# EasyEDA schematic SCH_TEST_2024-05-06.json

## Sheets
1 Sheet_1: TITLE: Sheet_1; REV: 1.0; Date: 2024-03-07; Sheet: 1/1; Drawn By: phuoc.chauphuocchau; Company: Your Company
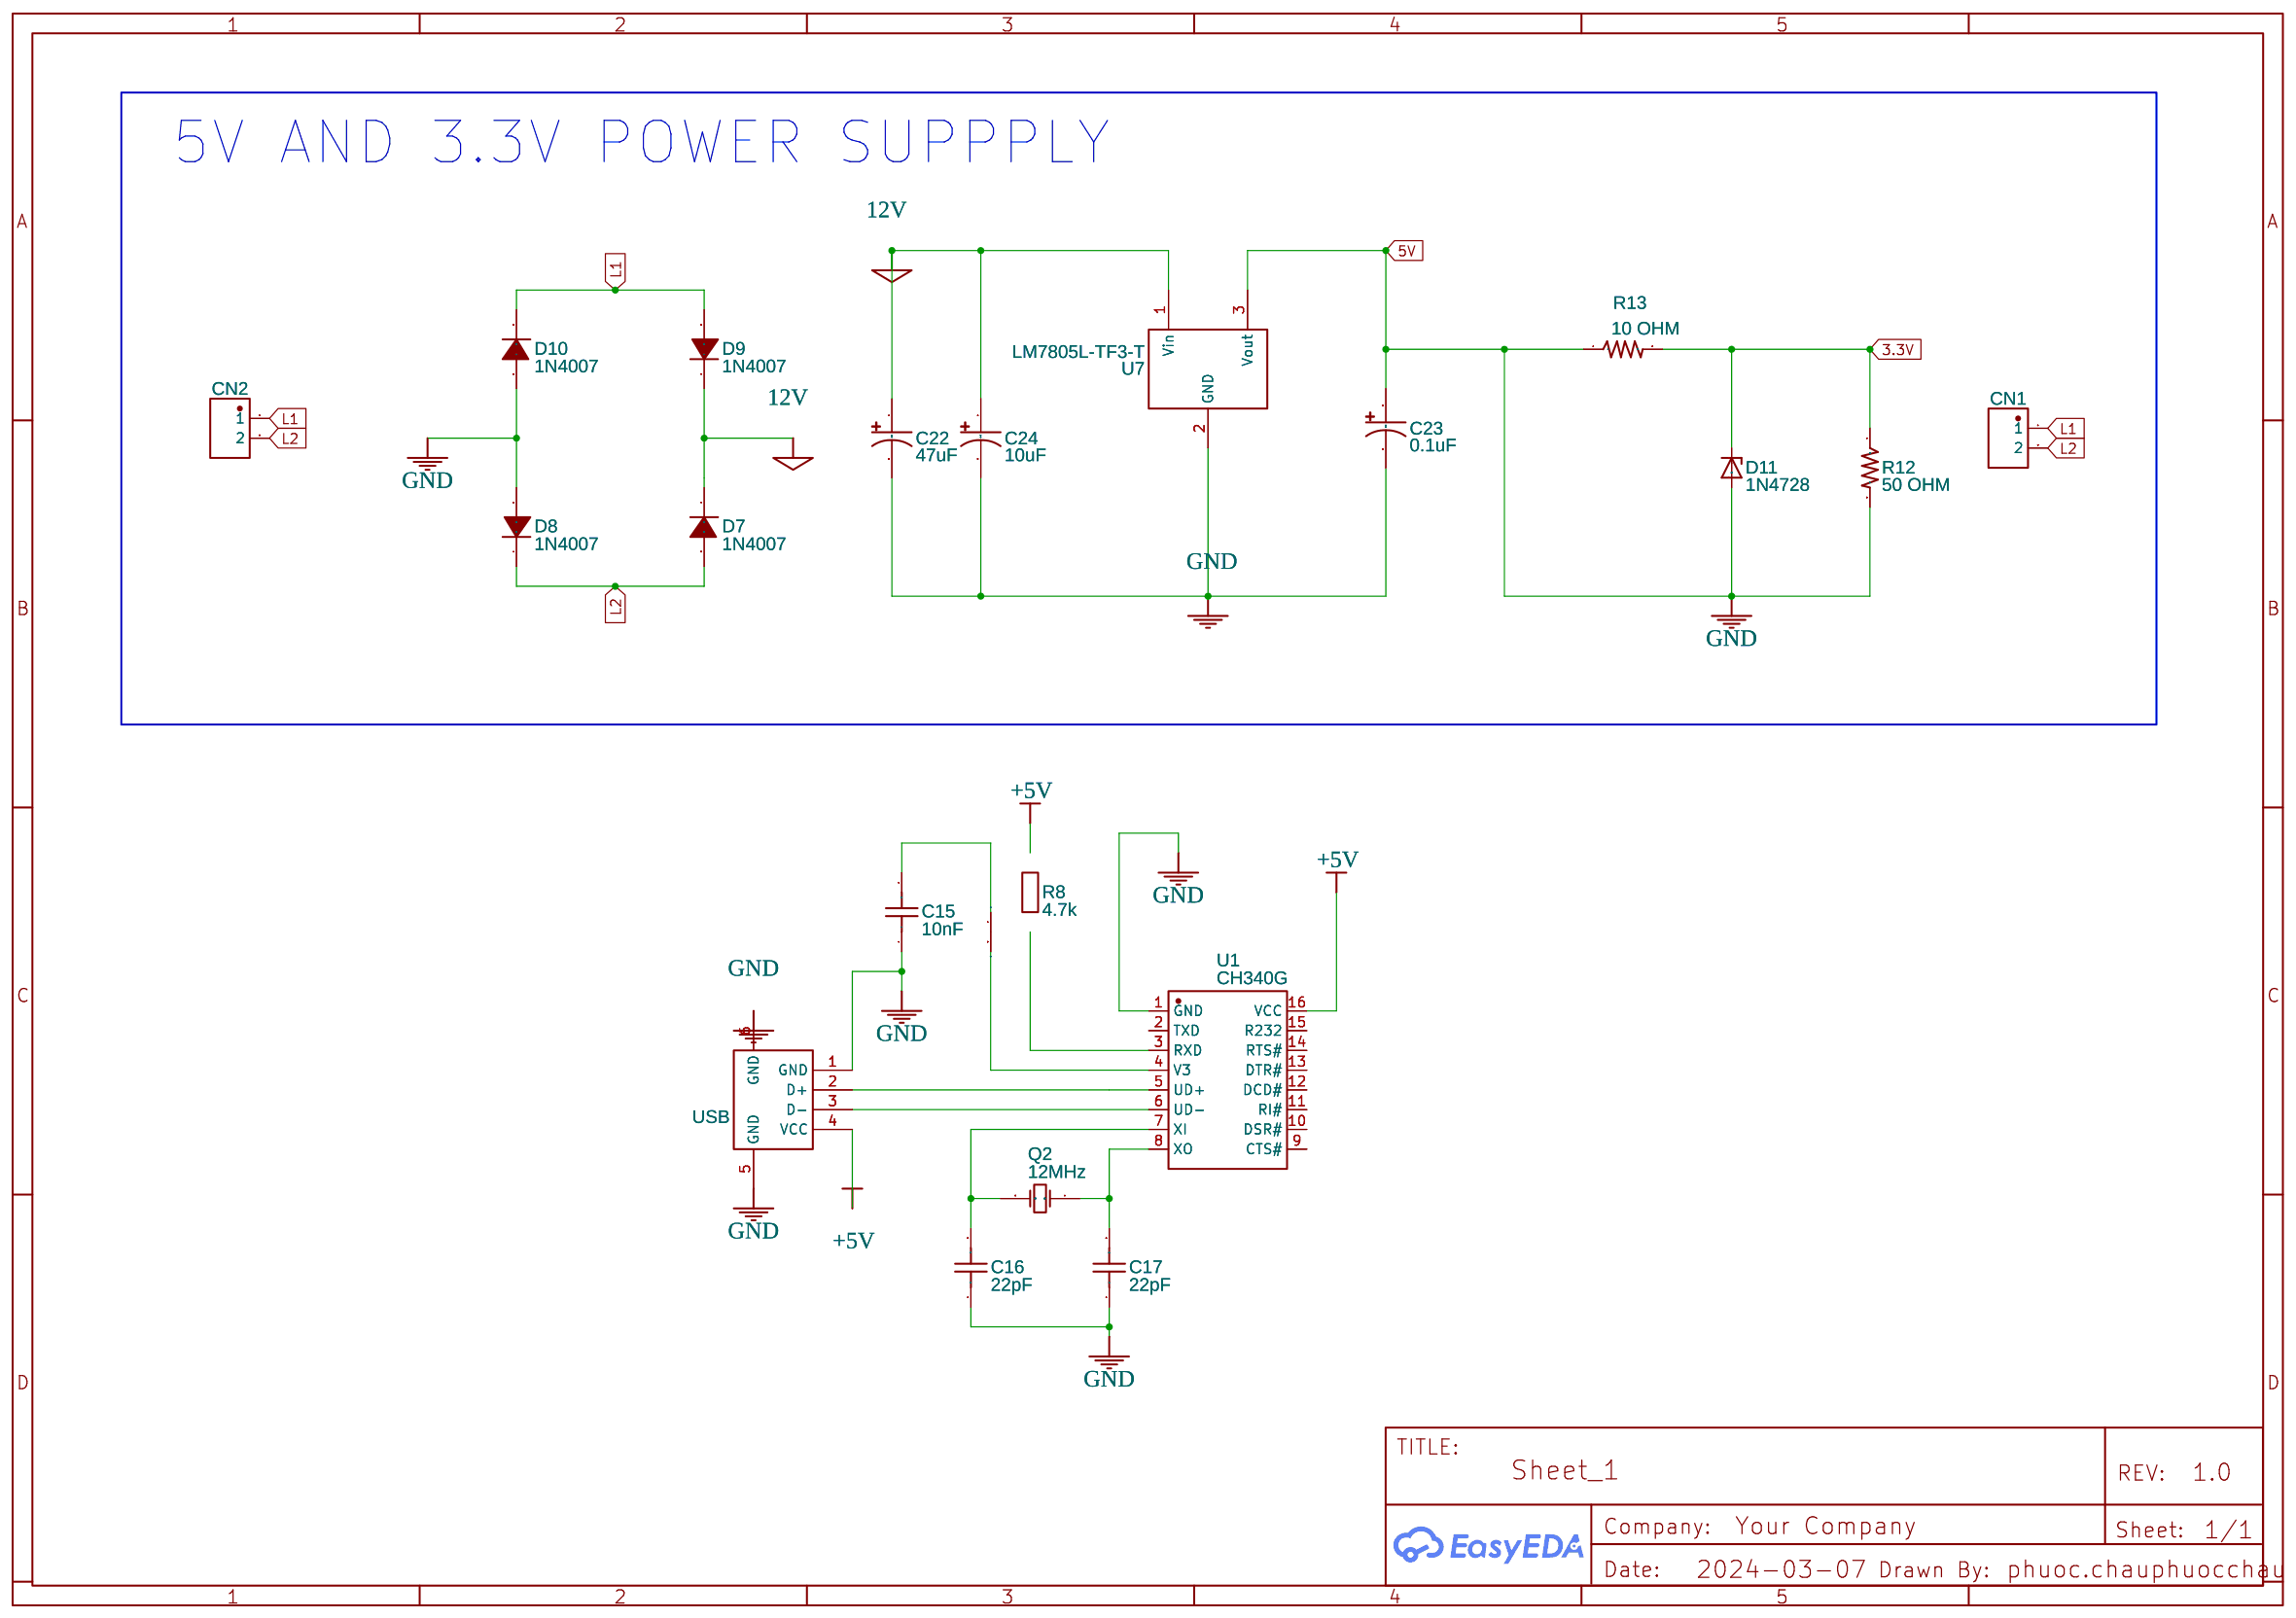
[diagram p0: Sheet_1]
2 Sheet_2: TITLE: Sheet_2; Date: 2024-04-19
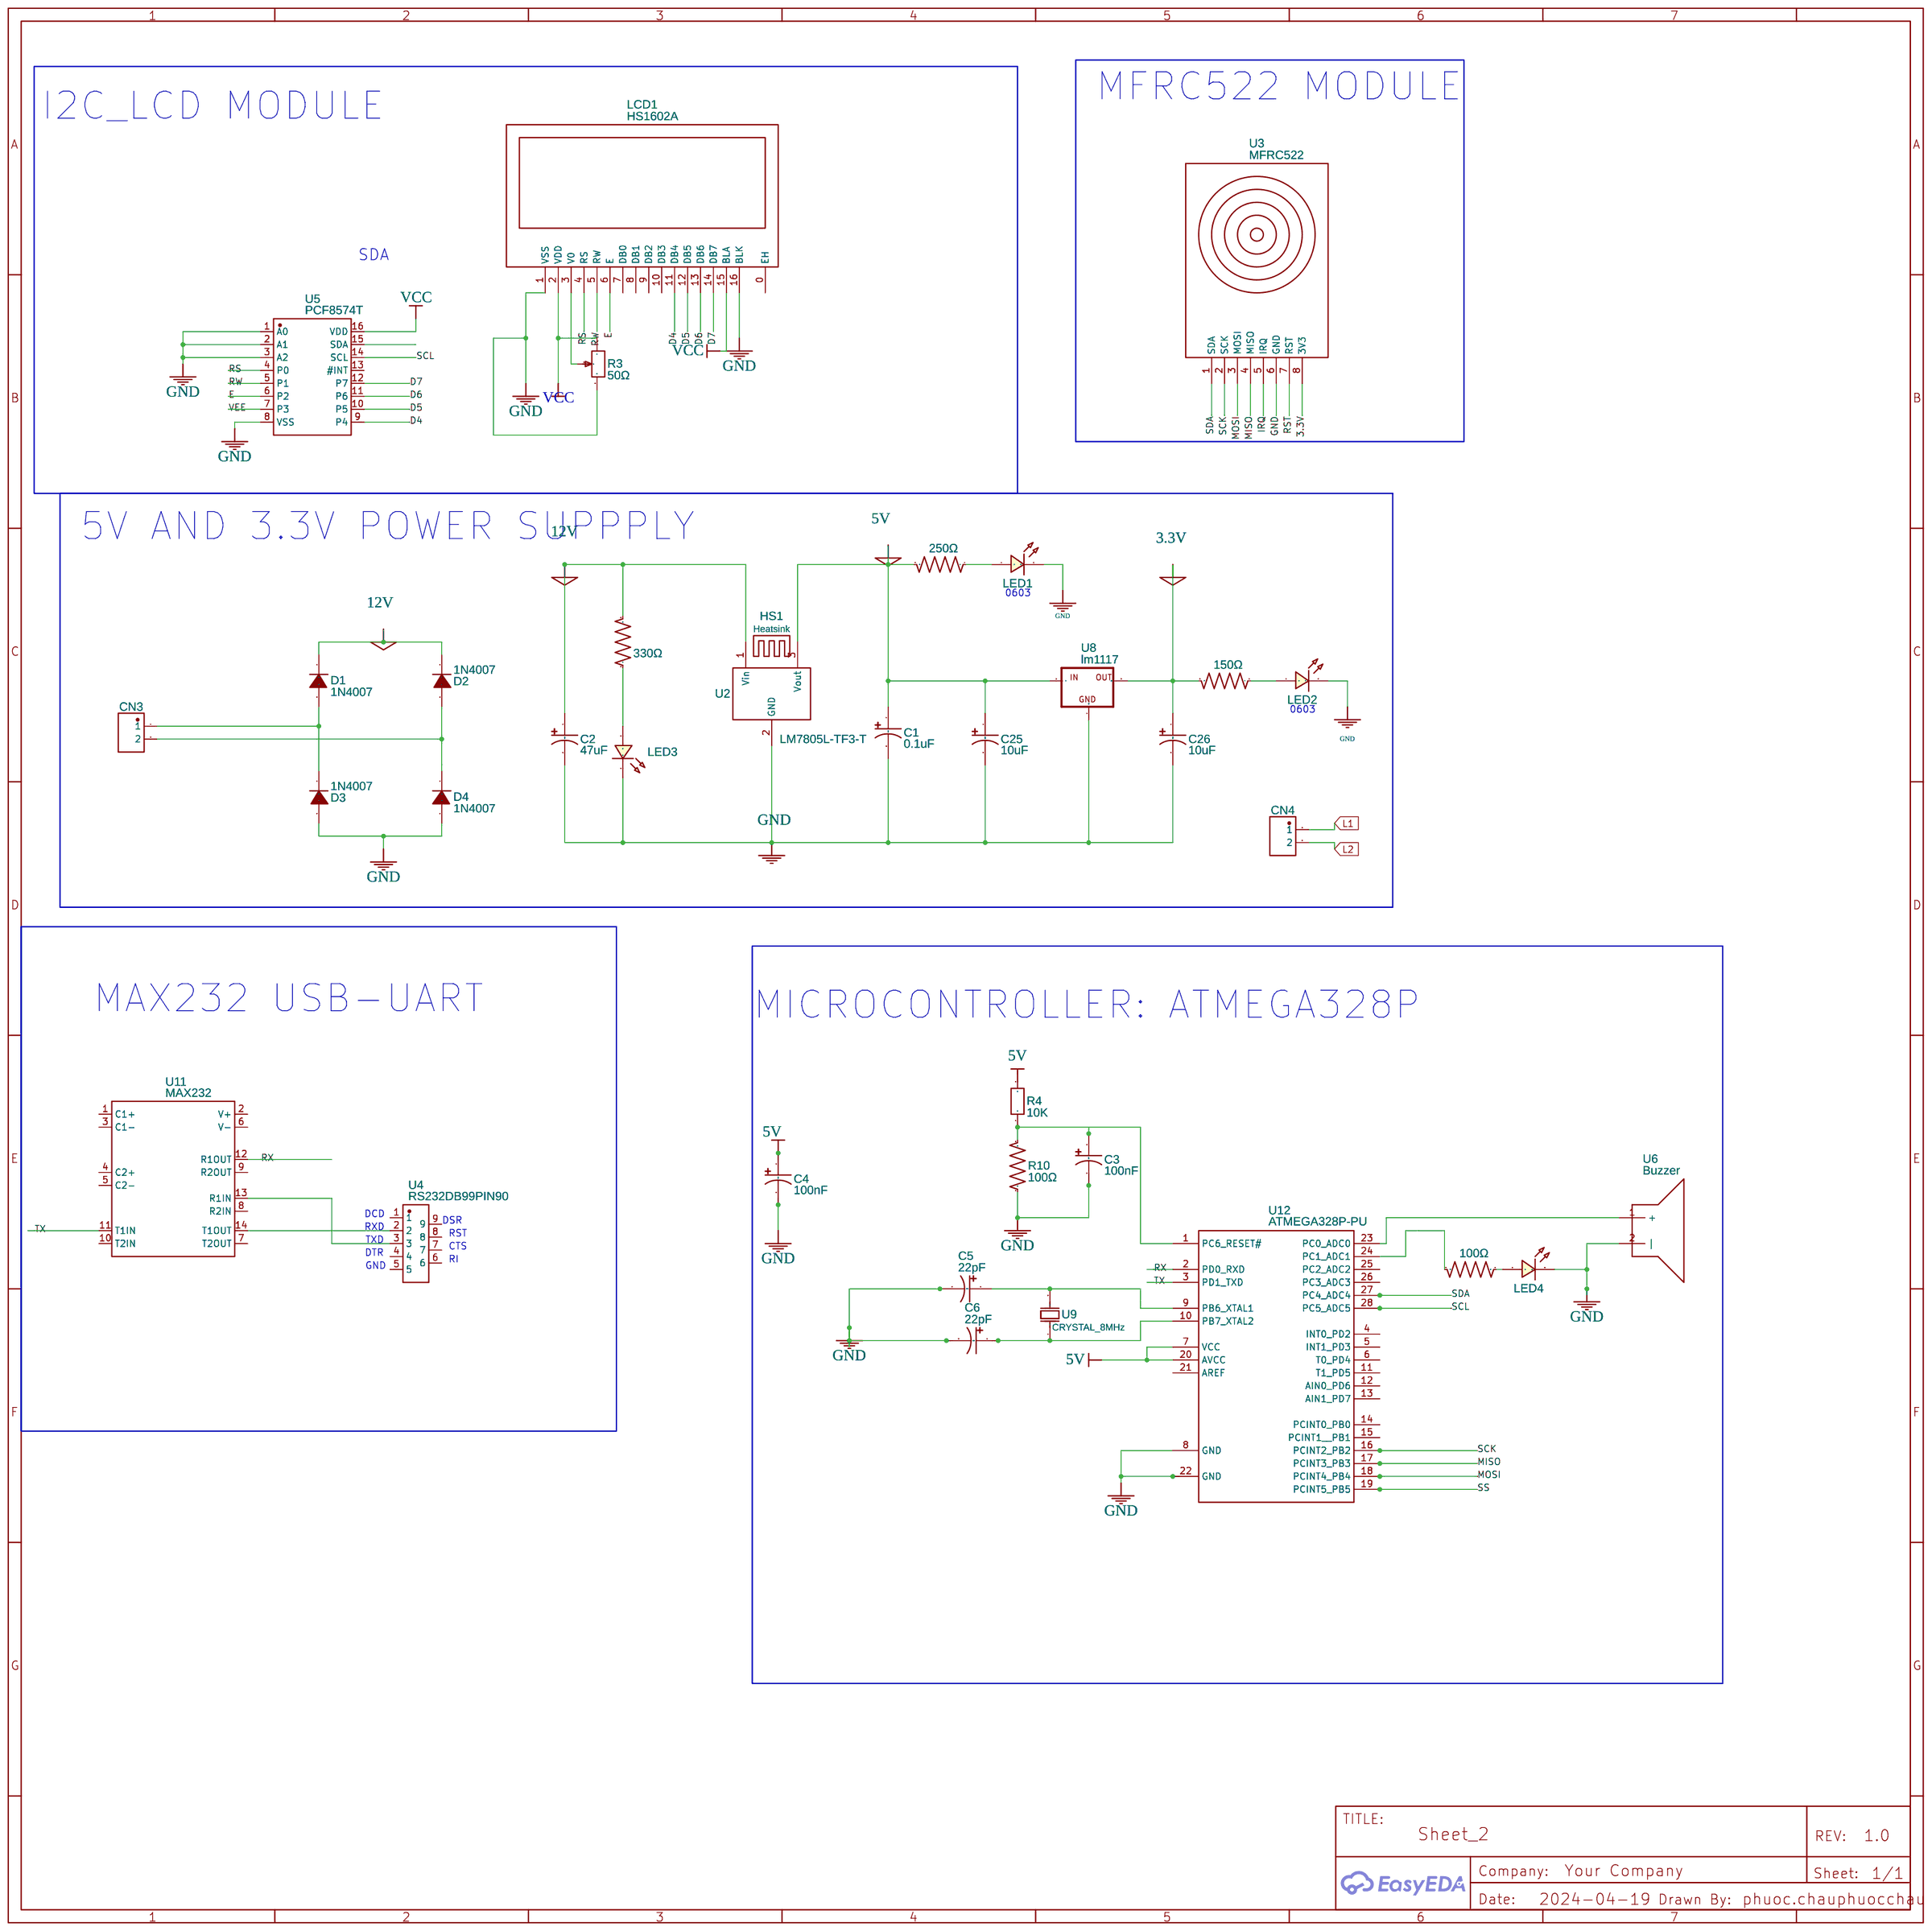
[diagram p1: Sheet_2]

## Parts
sheet Sheet_1
C15  10nF  [CAP-TH_L6.8-W2.6-P5.08-D0.6-S2.1]
C16  22pF  [CAP-TH_L6.8-W2.6-P5.08-D0.6-S2.1]
C17  22pF  [CAP-TH_L6.8-W2.6-P5.08-D0.6-S2.1]
C22  47uF  [CAP-T-10*12.6]
C23  0.1uF  [CAP-T-10*12.6]
C24  10uF  [CAP-T-10*12.6]
CN1  C2504WR-2P  [CONN-TH-2P_C2504WR-2P]
CN2  C2504WR-2P  [CONN-TH-2P_C2504WR-2P]
D7  1N4007  [DO-41_BD2.4-L4.7-P8.70-D0.9-RD]
D8  1N4007  [DO-41_BD2.4-L4.7-P8.70-D0.9-RD]
D9  1N4007  [DO-41_BD2.4-L4.7-P8.70-D0.9-RD]
D10  1N4007  [DO-41_BD2.4-L4.7-P8.70-D0.9-RD]
D11  1N4728  [DO41Z10]
Q2  12MHz  [1X02]
R8  4.7k  [R3]
R12  50 OHM  [0603-RES]
R13  10 OHM  [0603-RES]
U1  CH340G  [SOIC-16_L9.9-W3.9-P1.27-LS6.0-BL]
U7  LM7805L-TF3-T  [TO-220F-3_L10.2-W4.9-P2.54-L]
USB1  USB  [USB-A-SMD_USB-302S]
sheet Sheet_2
C1  0.1uF  [CAP-T-10*12.6]
C2  47uF  [CAP-T-10*12.6]
C3  100nF  [CAP-T-10*12.6]
C4  100nF  [CAP-T-10*12.6]
C5  22pF  [CAP-T-10*12.6]
C6  22pF  [CAP-T-10*12.6]
C25  10uF  [CAP-T-10*12.6]
C26  10uF  [CAP-T-10*12.6]
CN3  C2504WR-2P  [CONN-TH-2P_C2504WR-2P]
CN4  C2504WR-2P  [CONN-TH-2P_C2504WR-2P]
D1  1N4007  [DO-41_BD2.4-L4.7-P8.70-D0.9-RD]
D2  1N4007  [DO-41_BD2.4-L4.7-P8.70-D0.9-RD]
D3  1N4007  [DO-41_BD2.4-L4.7-P8.70-D0.9-RD]
D4  1N4007  [DO-41_BD2.4-L4.7-P8.70-D0.9-RD]
HS1  Heatsink  [HEATSINK-2]
LCD1  HS1602A  [LCD1602]
LED1  LED-0603_R  [LED0603_RED]
LED2  LED-0603_R  [LED0603_RED]
LED3  LED-0603_R  [LED0603_RED]
LED4  LED-0603_R  [LED0603_RED]
R1  330Ω  [RESISTOR100]
R2  150Ω  [RESISTOR100]
R3  50Ω  [RES-ADJ-TH_3296W]
R4  10K  [R0603]
R5  100Ω  [RESISTOR100]
R9  250Ω  [RESISTOR100]
R10  100Ω  [RESISTOR100]
U2  LM7805L-TF3-T  [TO-220F-3_L10.2-W4.9-P2.54-L]
U3  MFRC522  [MFRC522_FURO]
U4  RS232DB99PIN90  [DB9-TH_DB9-H-F_C2888345]
U5  PCF8574T  [SOP-16_L10.3-W7.5-P1.27-LS10.4-BL]
U6  Buzzer  [BUZZER]
U8  lm1117  [LM1117]
U9  CRYSTAL_8MHz  [CRYSTAL_8MHZ]
U11  MAX232  [MAX232(GK)]
U12  ATMEGA328P-PU  [DIP-28_L34.6-W7.3-P2.54-LS10.2-BL]

## Library data of the parts
C15-C17 = DCF102M26Y5VQ60L5A0: Contributor: lcsc; Supplier: LCSC; Supplier Part: C2875369; Manufacturer: SHM(南方宏明); JLCPCB Part Class: Extended Part
C1-C6 C22-C26 = OVZ471M1CTR-1013: Contributor: LCSC; Supplier: LCSC; Supplier Part: C311625; Manufacturer: Lelon
CN1-CN4 = C2504WR-2P: Contributor: LCSC; Supplier: LCSC; Supplier Part: C239432; Manufacturer: CJT(长江连接器); JLCPCB Part Class: Extended Part
D1-D4 D7-D10 = 1N4007: Supplier: LCSC; Manufacturer: ST(先科); Supplier Part: C106903; JLCPCB Part Class: Extended Part
D11 = 1N4728: Z DIODE
Q2 = XTALfast: Fseries(Hz): 10Meg; C0val(F): 3p; C1val(F): 10.6f; R1val(Ω): 50; Manufacturer Part: ?
R8 = Resistor: Manufacturer Part: ?
R12 = 1OHM1_10W1%(0603): RES-08269; Contributor: SparkFun
R13 = 2.2MOHM-1_10W-5%(0603): RES-09288; Contributor: SparkFun
U1 = CH340G: Supplier: LCSC; Manufacturer: WCH(南京沁恒); Supplier Part: C14267; JLCPCB Part Class: Extended Part
U2 U7 = LM7805L-TF3-T: Supplier: LCSC; Manufacturer: UTC(友顺); Supplier Part: C71107; JLCPCB Part Class: Extended Part
USB1 = USB-302S: Supplier: LCSC; Manufacturer: SOFNG(硕方); Manufacturer Part: USB-302S-T; Supplier Part: C112455; JLCPCB Part Class: Extended Part
HS1 = Heatsink-2: Contributor: cazzani
LCD1 = HS1602A: Supplier: LCSC; Supplier Part: C5329588; Manufacturer: HS(汉昇); Contributor: lcsc; JLCPCB Part Class: Extended Part
LED1-LED4 = LED-0603_R: Manufacturer: EVERLIGHT(台湾亿光); Manufacturer Part: 19-217/R6C-AL1M2VY/3T; Supplier Part: C72044; Supplier: LCSC; Contributor: LCEDA_01
R1 R2 R5 R9 R10 = 10Ω: Contributor: SimonMassey
R3 = Precision potentiometer 3296W/50ohm: Supplier Part: C21881; Supplier: LCSC; Manufacturer: ReliaPro; JLCPCB Part Class: Extended Part
R4 = R_0603_EU: Contributor: LCEDA_Lib
U3 = MFRC522_SYM COPY: catid: 20; Contributor: ismaelgregorio
U4 = RS232DB99PIN90: Contributor: LCSC; Supplier: LCSC; Supplier Part: C9900003665; Manufacturer: null; Manufacturer Part: RS232DB99pin90度母座; JLCPCB Part Class: Extended Part
U5 = PCF8574T: Contributor: LCSC; Supplier: LCSC; Supplier Part: C398075; Manufacturer: HGSEMI(华冠)
U6 = Buzzer: Manufacturer: Ing04; Contributor: MatiasCd07
U8 = lm1117: Contributor: kleverfp
U9 = CRYSTAL_8MHz: Contributor: Deepak Sahu; Supplier: LCSC; Supplier Part: C9900004908; Manufacturer: null; Manufacturer Part: RAD0.2-8MHz; JLCPCB Part Class: Extended Part
U11 = MAX232: Contributor: alexp12421
U12 = ATMEGA328P-PU: sourceId: Oic6oiASL; Contributor: LCSC; Supplier: LCSC; Manufacturer: MICROCHIP(美国微芯); Supplier Part: C33901; JLCPCB Part Class: Extended Part

## Nets
3.3V: C26.1 D11.C R2.2 R12.1 R13.2 U3.8(3V3) U8.2(OUT)
5V: C1.1 C1.2 C2.2 C3.2 C4.1 C4.2 C5.2 C6.2 C15.1 C16.1 C17.1 C22.2 C23.1 C23.2 C24.2 C25.1 C25.2 C26.2 D3.2(A) D4.2(A) D8.2(A) D10.2(A) D11.A LCD1.1(VSS) LCD1.16(BLK) LED1.2 LED2.2 LED3.2 LED4.2 R3.3 R4.2 R9.2 R10.1 R12.2 R13.1 U1.1(GND) U2.2(GND) U2.3(Vout) U3.6(GND) U5.1(A0) U5.2(A1) U5.3(A2) U5.8(VSS) U6.2(|) U7.2(GND) U7.3(Vout) U8.1(GND) U8.3(IN) U12.7(VCC) U12.8(GND) U12.20(AVCC) U12.22(GND) USB1.1(GND) USB1.5(GND) USB1.6(GND)
12V: C2.1 C22.1 C24.1 D1.1(K) D2.1(K) D7.1(K) D9.1(K) R1.2 U2.1(Vin) U7.1(Vin)
+5V: R8.2 U1.16(VCC) USB1.4(VCC)
VCC: LCD1.2(VDD) LCD1.15(BLA) R3.1 U5.16(VDD)
VEE: U5.7(P3)
D4: LCD1.11(DB4) U5.9(P4)
D5: LCD1.12(DB5) U5.10(P5)
D6: LCD1.13(DB6) U5.11(P6)
D7: LCD1.14(DB7) U5.12(P7)
E: LCD1.6(E) U5.6(P2)
IRQ: U3.5(IRQ)
L1: CN1.1 CN2.1 CN4.1 D9.2(A) D10.1(K)
L2: CN1.2 CN2.2 CN4.2 D7.2(A) D8.1(K)
MISO: U3.4(MISO) U12.17(PCINT3 PB3)
MOSI: U3.3(MOSI) U12.18(PCINT4 PB4)
RS: LCD1.4(RS) U5.4(P0)
RST: U3.7(RST)
RW: LCD1.5(RW) U5.5(P1)
RX: U11.12(R1OUT) U12.2(PD0 RXD)
SCK: U3.2(SCK) U12.16(PCINT2 PB2)
SCL: U5.14(SCL) U12.28(PC5 ADC5)
SDA: U3.1(SDA) U12.27(PC4 ADC4)
SS: U12.19(PCINT5 PB5)
TX: U11.11(T1IN) U12.3(PD1 TXD)
Net-(C3-1): C3.1 R4.1 R10.2 U12.1(PC6 RESET#)
Net-(C5-1): C5.1 U9.2 U12.9(PB6 XTAL1)
Net-(C6-1): C6.1 U9.1 U12.10(PB7 XTAL2)
Net-(C15-2): C15.2 U1.4(V3)
Net-(C16-2): C16.2 Q2.2(OSC2) U1.7(XI)
Net-(C17-2): C17.2 Q2.1(OSC1) U1.8(XO)
Net-(CN3-1): CN3.1 D1.2(A) D3.1(K)
Net-(CN3-2): CN3.2 D2.2(A) D4.1(K)
Net-(LCD1-3): LCD1.3(V0) R3.2
Net-(LED1-1): LED1.1 R9.1
Net-(LED2-1): LED2.1 R2.1
Net-(LED3-1): LED3.1 R1.1
Net-(LED4-1): LED4.1 R5.1
Net-(R5-2): R5.2 U12.24(PC1 ADC1)
Net-(R8-1): R8.1 U1.3(RXD)
Net-(U1-5): U1.5(UD+) USB1.2(D+)
Net-(U1-6): U1.6(UD-) USB1.3(D-)
Net-(U4-2): U4.2 U11.14(T1OUT)
Net-(U4-3): U4.3 U11.13(R1IN)
Net-(U6-1): U6.1(+) U12.23(PC0 ADC0)

Not connected (* = marked no-connect by the designer): LCD1 0(EH) 7(DB0) 8(DB1) 9(DB2) 10(DB3); U1 2(TXD) 9(CTS#) 10(DSR#) 11(RI#) 12(DCD#) 13(DTR#) 14(RTS#) 15(R232); U4 1 4 5 6 7 8 9; U5 13(#INT) 15(SDA); U11 1(C1+) 2(V+) 3(C1-) 4(C2+) 5(C2-) 6(V-) 7(T2OUT) 8(R2IN) 9(R2OUT) 10(T2IN); U12 4(INT0 PD2) 5(INT1 PD3) 6(T0 PD4) 11(T1 PD5) 12(AIN0 PD6) 13(AIN1 PD7) 14(PCINT0 PB0) 15(PCINT1  PB1) 21(AREF) 25(PC2 ADC2) 26(PC3 ADC3)

## Notes on the sheets
sheet 1
- 5V AND 3.3V POWER SUPPPLY
sheet 2
- MFRC522 MODULE
- I2C_LCD MODULE
- SDA
- 5V AND 3.3V POWER SUPPPLY
- 0603
- 0603
- MAX232 USB-UART
- MICROCONTROLLER: ATMEGA328P
- DCD
- DSR
- RXD
- TXD
- RST
- DTR
- CTS
- GND
- RI
